# EAGLE schematic module_RevB (EAGLE 9.1.1)
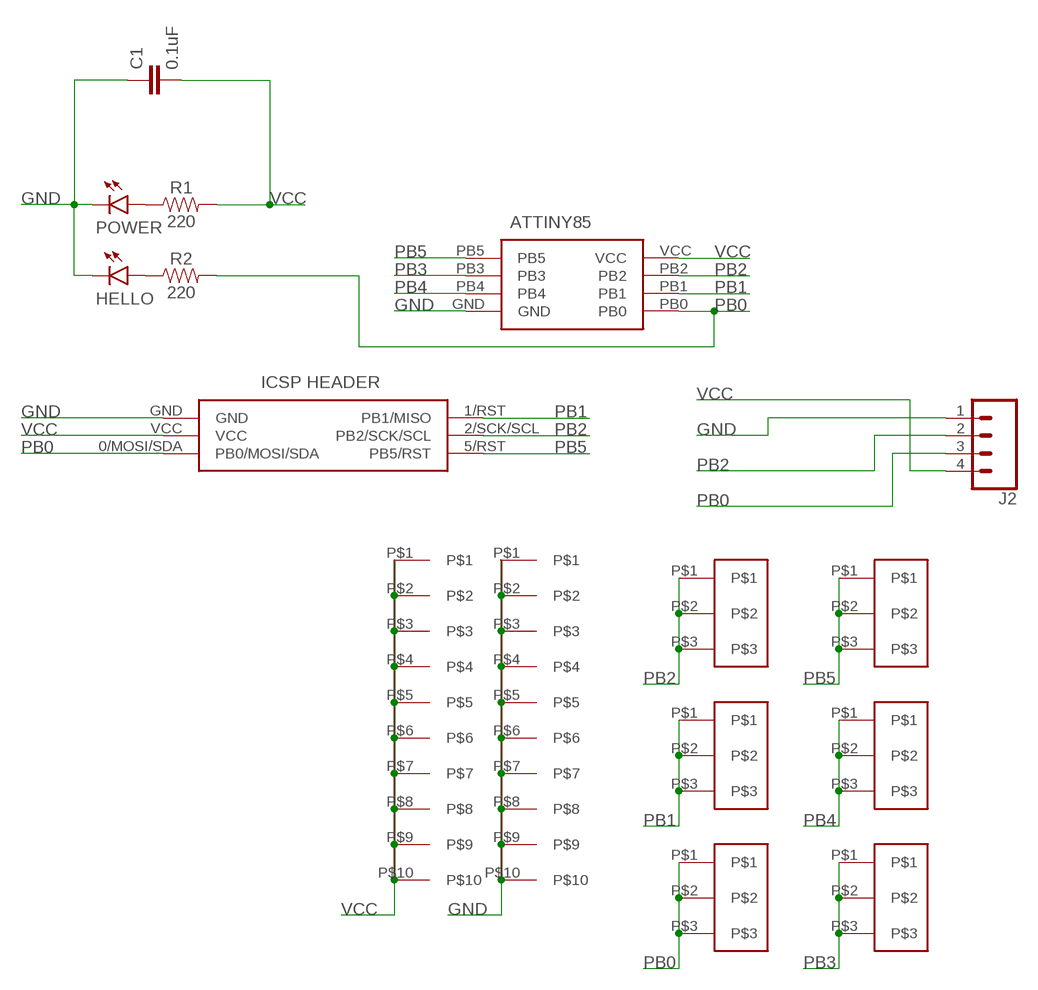
[diagram p0: schematic, sheet 1]

## Parts
0  3X-PADS-CONNECTED  [3X-PADS]
1  3X-PADS-CONNECTED  [3X-PADS]
2  3X-PADS-CONNECTED  [3X-PADS]
3  3X-PADS-CONNECTED  [3X-PADS]
4  3X-PADS-CONNECTED  [3X-PADS]
5  3X-PADS-CONNECTED  [3X-PADS]
C1  0.1uF  0.1UF-0603-25V-5%  [0603]
GND  10X-PADS  [10X-PADS]
HELLO  LED3MM  [LED3MM]
IC1  ATTINY85-20SU  [SOT127P798X216-8N]
J1  M20-9980346  [HDRV6W64P254_2X3_762X508X868P]
J2  CONN_04  [1X04]
POWER  LED3MM  [LED3MM]
R1  220  RESISTORAXIAL-0.3  [AXIAL-0.3]
R2  220  RESISTORAXIAL-0.3  [AXIAL-0.3]
VCC  10X-PADS  [10X-PADS]

## Nets
GND [GND]: C1.1 GND.P$1 GND.P$2 GND.P$3 GND.P$4 GND.P$5 GND.P$6 GND.P$7 GND.P$8 GND.P$9 GND.P$10 HELLO.NEG IC1.GND J1.GND J2.1 POWER.NEG
N$1: POWER.POS R1.P$1
N$3: HELLO.POS R2.P$1
PB0: 0.P$1 0.P$2 0.P$3 IC1.PB0 J1.0/MOSI/SDA(PB0/MOSI/SDA) J2.3 R2.P$2
PB1: 1.P$1 1.P$2 1.P$3 IC1.PB1 J1.1/RST(PB1/MISO)
PB2: 2.P$1 2.P$2 2.P$3 IC1.PB2 J1.2/SCK/SCL(PB2/SCK/SCL) J2.2
PB3: 3.P$1 3.P$2 3.P$3 IC1.PB3
PB4: 4.P$1 4.P$2 4.P$3 IC1.PB4
PB5: 5.P$1 5.P$2 5.P$3 IC1.PB5 J1.5/RST(PB5/RST)
VCC [VCC]: C1.2 IC1.VCC J1.VCC J2.4 R1.P$2 VCC.P$1 VCC.P$2 VCC.P$3 VCC.P$4 VCC.P$5 VCC.P$6 VCC.P$7 VCC.P$8 VCC.P$9 VCC.P$10

## Library data of the parts
0 1-5 = BadgeParts:3X-PADS-CONNECTED
C1 = SparkFun-Capacitors:0.1UF: 0.1µF ceramic capacitors A capacitor is a passive two-terminal electrical component used to store electrical energy temporarily in an electric field.; PROD_ID: CAP-08604
GND VCC = BadgeParts:10X-PADS
HELLO POWER = BadgeParts:LED3MM
IC1 = BadgeParts:ATTINY85-20SU: MICROCHIP - ATTINY85-20SU - MICROCONTROLLER MCU, 8 BIT, ATTINY, 20MHZ, SOIC-8 Source: Datasheet <https://componentsearchengine.com/Datasheets/2/ATTINY85-20SU.pdf>; ARROW_PART_NUMBER: ATTINY85-20SU; ARROW_PRICE/STOCK: https://www.arrow.com/en/products/attiny85-20su/microchip-technology; DESCRIPTION: MICROCHIP - ATTINY85-20SU - MICROCONTROLLER MCU, 8 BIT, ATTINY, 20MHZ, SOIC-8; HEIGHT: 2.16mm; MANUFACTURER_NAME: Microchip; MANUFACTURER_PART_NUMBER: ATTINY85-20SU; RS_PART_NUMBER: 1331674; RS_PRICE/STOCK: http://uk.rs-online.com/web/p/products/1331674
J1 = BadgeParts:M20-9980346: 03+03 DIL Vertical Pin Header HARWIN M20 Series, 2.54mm Pitch 6 Way 2 Row Straight PCB Header, Solder Termination, 3A Source: Datasheet <https://cdn.harwin.com/pdfs/M20-998.pdf?utm_source=3D_PDF&utm_medium=3D_PDF&utm_campaign=3D_PDF>; ARROW_PART_NUMBER: M20-9980346; ARROW_PRICE/STOCK: http://uk.rs-online.com/web/p/products/7457046P; DESCRIPTION: 03+03 DIL Vertical Pin Header HARWIN M20 Series, 2.54mm Pitch 6 Way 2 Row Straight PCB Header, Solder Termination, 3A; HEIGHT: 8.68mm; MANUFACTURER_NAME: HARWIN; MANUFACTURER_PART_NUMBER: M20-9980346; RS_PART_NUMBER: 7457046P; RS_PRICE/STOCK: http://uk.rs-online.com/web/p/products/7457046P
J2 = SparkFun-Connectors:CONN_04: Multi connection point. Often used as Generic Header-pin footprint for 0.1 inch spaced/style header connections On any of the 0.1 inch spaced packages, you can populate with these: Break Away Headers - Straight <https://www.sparkfun.com/products/116> (PRT-00116) Break Away Male Headers - Right Angle <https://www.sparkfun.com/products/553> (PRT-00553) Female Headers <https://www.sparkfun.com/products/115> (PRT-00115) Break Away Headers - Machine Pin <https://www.sparkfun.com/products/117> (PRT-00117) Break Away Female Headers - Swiss Machine Pin <https://www.sparkfun.com/products/743> (PRT-00743) For SCREWTERMINALS and SPRING TERMINALS visit here: Screw Terimnals on SparkFun.com <https://www.sparkfun.com/search/results?term=Screw+Terminals> (5mm/3.5mm/2.54mm spacing) This device is also useful as a general connection point to wire up your design to another part of your project. Our various solder wires solder well into these plated through hole pads. Hook-Up Wire - Assortment (Stranded, 22 AWG) <https://www.sparkfun.com/products/11375> (PRT-11375) Hook-Up Wire - Assortment (Solid Core, 22 AWG) <https://www.sparkfun.com/products/11367> (PRT-11367) View the entire wire category on our website here <https://www.sparkfun.com/categories/141> Special notes: Molex polarized connector foot print use with SKU : PRT-08231 with associated crimp pins and housings. 1MM SMD Version SKU: PRT-10208; PROD_ID: CONN-09696
R1 R2 = SparkFun-Resistors:RESISTOR: Generic Resistor Package

## Net classes
0 default: width 0.254 mm, clearance 0.381 mm
1 VCC: width 0.635 mm, clearance 0.381 mm
2 GND: width 0.635 mm, clearance 0.381 mm